# Altium project 越野组一体板.PrjPCB
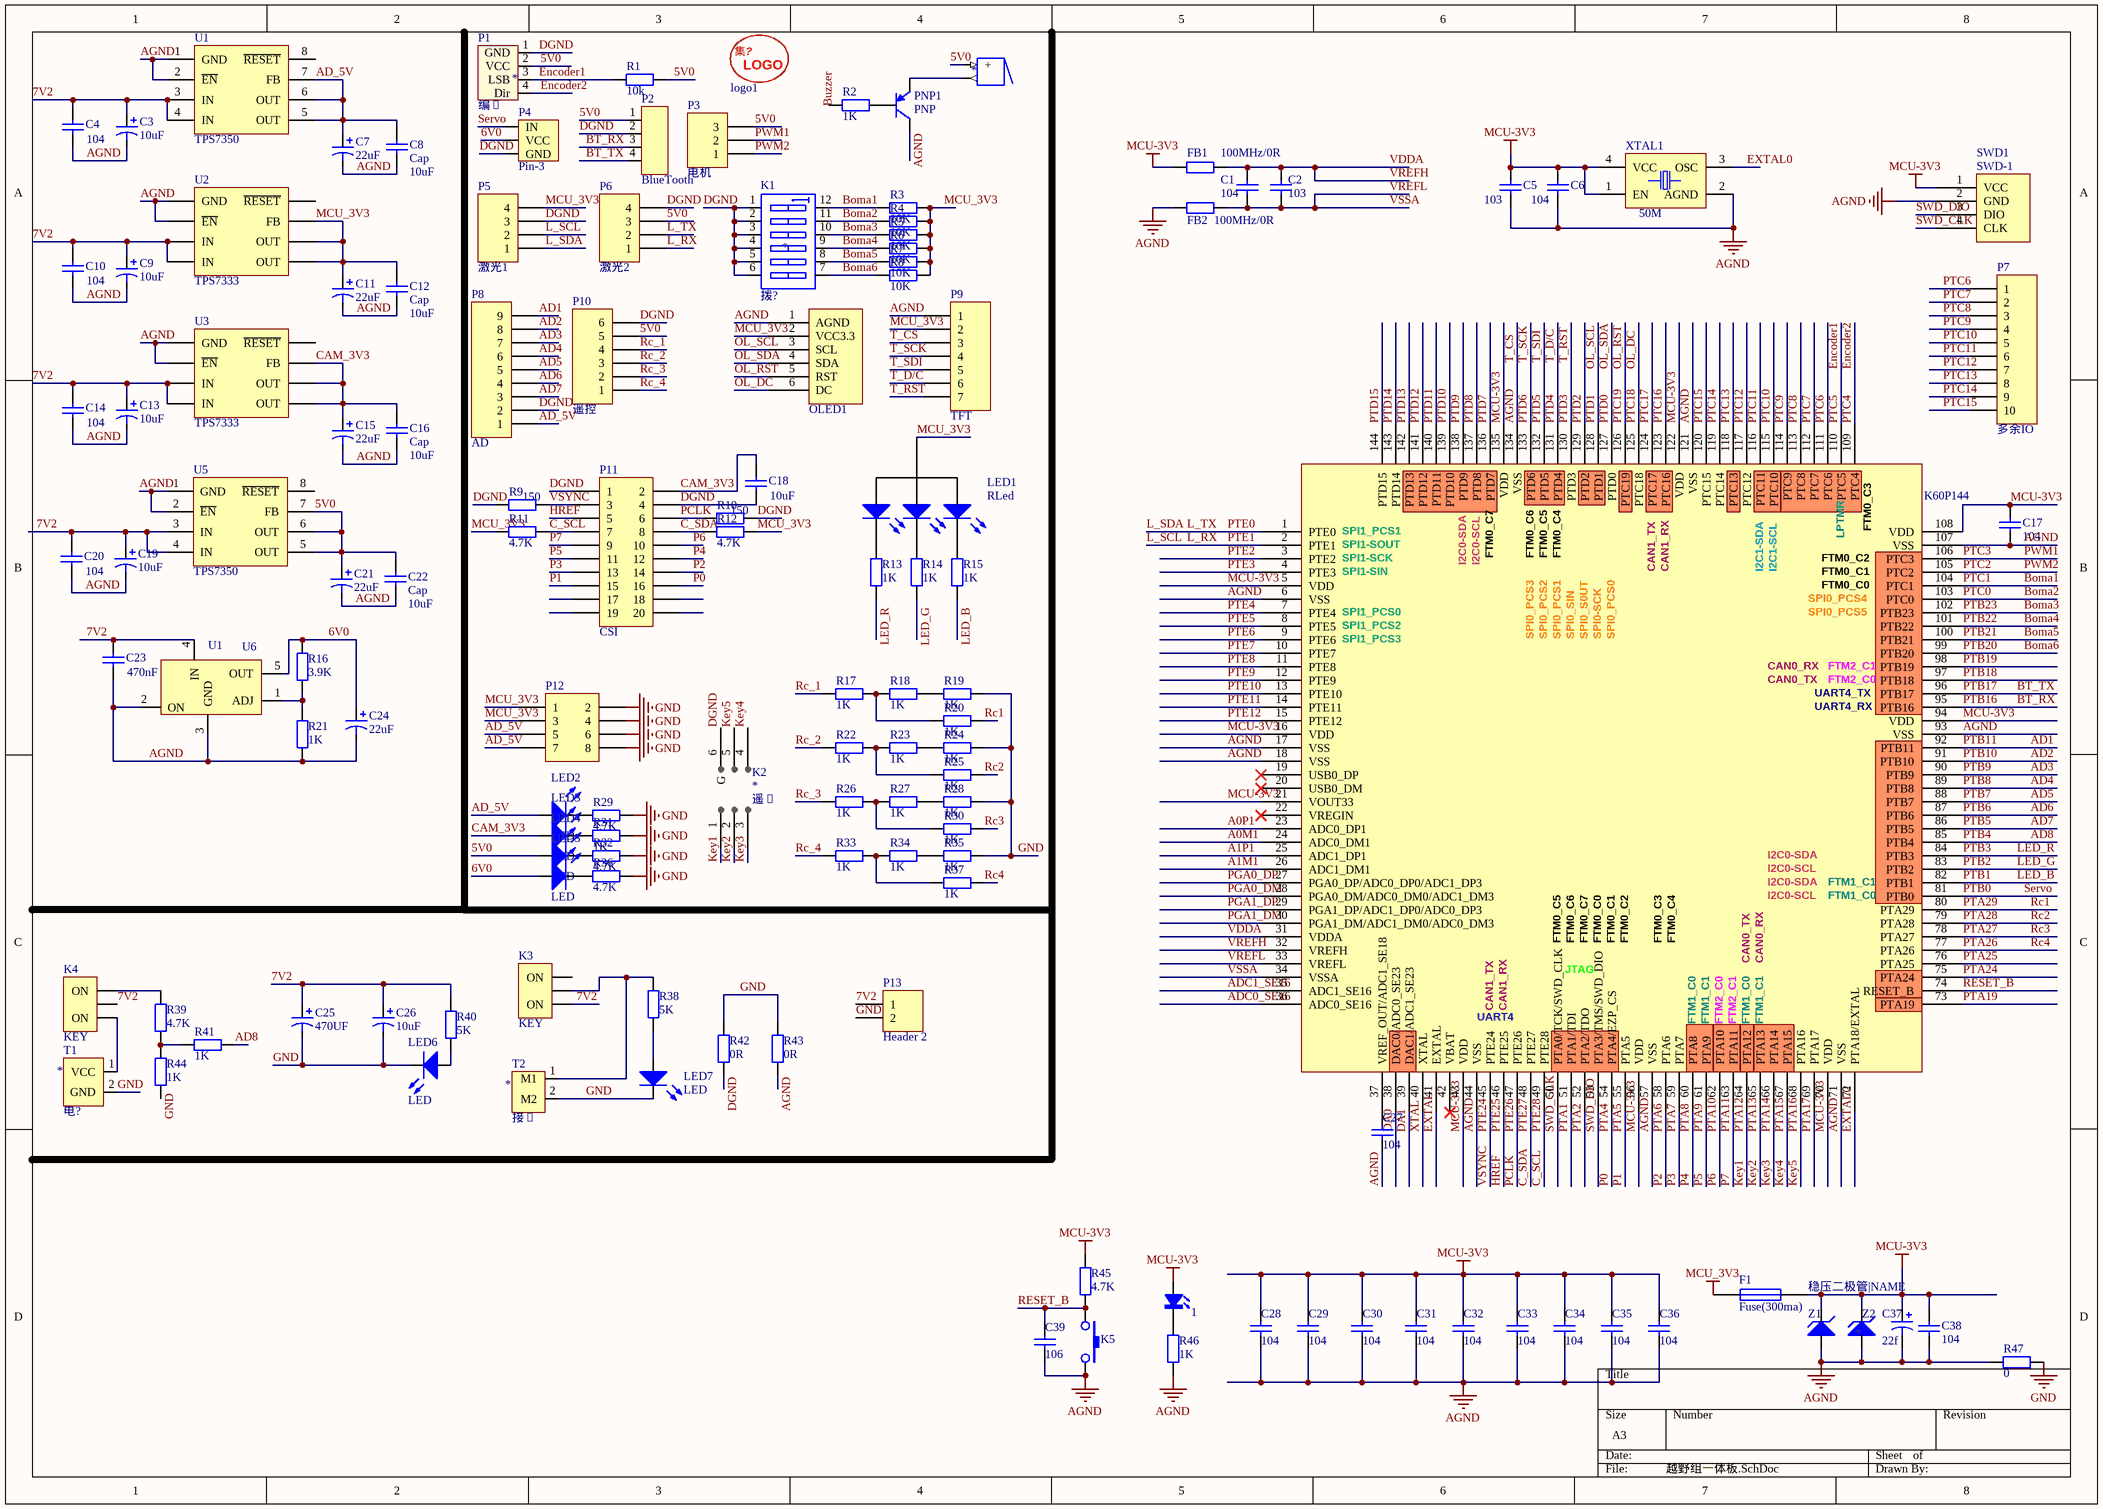
[diagram p0: 越野组一体板.SchDoc]
1 sheet, 131 parts. Net scope: global (net labels, ports and power ports of the same name join across sheets).
Board file: 越野组一体板.PcbDoc

## Sheet 越野组一体板.SchDoc
size A3

### Parts
1  LED  [0805LED1]  (value not drawn)
BUZZER1  *  [Buzzer]
C1  104  [0805-0C]
C2  103  [0805-0C]
C3  value 10uF  [pol cap(10uF)]  (hidden comment: pol cap)
C4  value 104  [0805]
C5  103  [0805-0C]
C6  104  [0805-0C]
C7  value 22uF  [pol cap(10uF)]  (hidden comment: pol cap)
C8  Cap  value 10uF  [0805]
C9  value 10uF  [pol cap(10uF)]  (hidden comment: pol cap)
C10  value 104  [0805]
C11  value 22uF  [pol cap(10uF)]  (hidden comment: pol cap)
C12  Cap  value 10uF  [0805]
C13  value 10uF  [pol cap(10uF)]  (hidden comment: pol cap)
C14  value 104  [0805]
C15  value 22uF  [pol cap(10uF)]  (hidden comment: pol cap)
C16  Cap  value 10uF  [0805]
C17  104  [0805-0C]
C18  value 10uF  [0805]
C19  value 10uF  [pol cap(10uF)]  (hidden comment: pol cap)
C20  value 104  [0805]
C21  value 22uF  [pol cap(10uF)]  (hidden comment: pol cap)
C22  Cap  value 10uF  [0805]
C23  value 470nF  [0805]
C24  value 22uF  [pol cap(10uF)]  (hidden comment: pol cap)
C25  470UF  [ED8]
C26  value 10uF  [pol cap(10uF)]  (hidden comment: 1UF)
C27  104  [0805-0C]
C28  104  [0805-0C]
C29  104  [0805-0C]
C30  104  [0805-0C]
C31  104  [0805-0C]
C32  104  [0805-0C]
C33  104  [0805-0C]
C34  104  [0805-0C]
C35  104  [0805-0C]
C36  104  [0805-0C]
C37  22f  [3528-B-TA]
C38  104  [0805-0C]
C39  106  [0805-0C]
F1  Fuse(300ma)  [1206R]
FB1  100MHz/0R  [0805]
FB2  100MHz/0R  [0805]
K1  *  [拨码开关*6]
K2  *  [摇杆开关]
K3  KEY  [钮子开关（大）]
K4  KEY  [钮子开关（大）]
K5  RESET  [SW_PB2_A1]  (value not drawn)
LED1  RLed  [Rled]
LED2  LED  [LED(0805)]
LED3  LED  [LED(0805)]
LED4  LED  [LED(0805)]
LED5  LED  [LED(0805)]
LED6  LED  [LED(0805)]
LED7  LED  [LED(0805)]
logo1  LOGO(JMU)  [JMU_logo（1）]  (value not drawn)
OLED1  OLED  [S0P6]  (value not drawn)
P1  *  [编码器]
P2  BlueTooth  [插针——4]
P3  电机  [HDR1X3]
P4  Pin-3  [HDR_1X3]
P5  激光1  [HDR1X4]
P6  激光2  [HDR1X4]
P7  多余IO  [HDR1X10]
P8  AD  [HDR1X9]
P9  TFT  [HDR1X7]
P10  遥控  [HDR1X6]
P11  CSI  [HDR2X10]
P12  Header 4X2  [HDR2X4]  (value not drawn)
P13  Header 2  [HDR1X2]
PNP1  PNP  [PNP]
R1  10k  [0805]
R2  1K  [0805]
R3  10K  [0805]
R4  10K  [0805]
R5  10K  [0805]
R6  10K  [0805]
R7  10K  [0805]
R8  10K  [0805]
R9  150  [0805]
R10  150  [0805]
R11  4.7K  [0805]
R12  4.7K  [0805]
R13  1K  [0805]
R14  1K  [0805]
R15  1K  [0805]
R16  3.9K  [0805]
R17  1K  [0805]
R18  1K  [0805]
R19  1K  [0805]
R20  1K  [0805]
R21  1K  [0805]
R22  1K  [0805]
R23  1K  [0805]
R24  1K  [0805]
R25  1K  [0805]
R26  1K  [0805]
R27  1K  [0805]
R28  1K  [0805]
R29  4.7K  [0805]
R30  1K  [0805]
R31  1K  [0805]
R32  4.7K  [0805]
R33  1K  [0805]
R34  1K  [0805]
R35  1K  [0805]
R36  4.7K  [0805]
R37  1K  [0805]
R38  5K  [0805]
R39  4.7K  [0805]
R40  5K  [0805]
R41  1K  [0805]
R42  0R  [0805]
R43  0R  [0805]
R44  1K  [0805]
R45  4.7K  [0603-r]
R46  1K  [0603-r]
R47  0  [0603-r]
SWD1  SWD-1  [S0P4]  (value not drawn)
T1  *  [T型接头]
T2  *  [接线端子]
U1  TPS7350  [SOIC-8]
U2  TPS7333  [SOIC-8]
U3  TPS7333  [SOIC-8]
U4  K60P144  [LQFP144]
U5  TPS7350  [SOIC-8]
U6  U1  [LM2941]
XTAL1  50M  [XTAL-3225]
Z1  Zener  [0805-0C]  (value not drawn)
Z2  *  [0805-0C]

### Nets
AGND: C3.2 C4.1 C5.2 C6.1 C7.2 C8.1 C9.2 C10.1 C11.2 C12.1 C13.2 C14.1 C15.2 C16.1 C17.2 C19.2 C20.1 C21.2 C22.1 C23.1 C24.2 C27.1 C28.1 C29.1 C30.1 C31.1 C32.1 C33.1 C34.1 C35.1 C36.1 C37.2 C38.2 C39.1 FB2.2 K5.2 OLED1.1(AGND) P9.1 P9.3 PNP1.1(C) R21.1 R43.2 R46.1 R47.1 SWD1.2(GND) U1.1(GND) U1.2(~{EN}) U2.1(GND) U2.2(~{EN}) U3.1(GND) U3.2(~{EN}) U4.6(VSS) U4.17(VSS) U4.18(VSS) U4.44(VSS) U4.57(VSS) U4.71(VSS) U4.93(VSS) U4.107(VSS) U4.121(VSS) U4.134(VSS) U5.1(GND) U5.2(~{EN}) U6.2(ON) U6.3(GND) XTAL1.2(AGND) Z1.1(A) Z2.1(A)  [also labelled T_CS]
GND: C25.2 C26.2 LED6.2(K) LED7.2(K) P12.2 P12.4 P12.6 P12.8 P13.2 R19.2 R24.2 R28.2 R29.2 R31.2 R32.2 R35.2 R36.2 R42.1 R43.1 R47.2 T1.2(GND) T2.2(M2)
MCU-3V3: 1.1(K) C5.1 C6.2 C17.1 C28.2 C29.2 C30.2 C31.2 C32.2 C33.2 C34.2 C35.2 C36.2 C37.1 C38.1 F1.1 FB1.2 R45.2 SWD1.1(VCC) U4.5(VDD) U4.16(VDD) U4.21(VOUT33) U4.43(VDD) U4.56(VDD) U4.70(VDD) U4.94(VDD) U4.108(VDD) U4.122(VDD) U4.135(VDD) XTAL1.1(EN) XTAL1.4(VCC) Z1.2(K) Z2.2(K)
MCU_3V3: C11.1 C12.2 F1.2 LED1.4(K4) OLED1.2(VCC3.3) P5.4 P9.2 P12.1 P12.3 R3.1 R4.1 R5.1 R6.1 R7.1 R8.1 R11.1 R12.2 U2.5(OUT) U2.6(OUT) U2.7(FB)
5V0: BUZZER1.1(+) C21.1 C22.2 LED4.1(A) P1.2(VCC) P2.1 P3.3 P6.3 P10.5 R1.2 U5.5(OUT) U5.6(OUT) U5.7(FB)
6V0: C24.1 LED5.1(A) P4.2(VCC) R16.2 U6.5(OUT)
7V2: C3.1 C4.2 C9.1 C10.2 C13.1 C14.2 C19.1 C20.2 C23.2 C25.1 C26.1 K3.1(ON) K4.2(com) P13.1 R40.2 U1.3(IN) U1.4(IN) U2.3(IN) U2.4(IN) U3.3(IN) U3.4(IN) U5.3(IN) U5.4(IN) U6.4(IN)
A0M1: U4.24(ADC0_DM1)
A0P1: U4.23(ADC0_DP1)
A1M1: U4.26(ADC1_DM1)
A1P1: U4.25(ADC1_DP1)
AD1: P8.9 U4.92(PTB11)  [also labelled PTB11]
AD2: P8.8 U4.91(PTB10)  [also labelled PTB10]
AD3: P8.7 U4.90(PTB9)  [also labelled PTB9]
AD4: P8.6 U4.89(PTB8)  [also labelled PTB8]
AD5: P8.5 U4.88(PTB7)  [also labelled PTB7]
AD6: P8.4 U4.87(PTB6)  [also labelled PTB6]
AD7: P8.3 U4.86(PTB5)  [also labelled PTB5]
AD8: R41.1 U4.85(PTB4)  [also labelled PTB4]
AD_5V: C7.1 C8.2 LED2.1(A) P8.1 P12.5 P12.7 U1.5(OUT) U1.6(OUT) U1.7(FB)
ADC0_SE16: U4.36(ADC0_SE16)
ADC1_SE16: U4.35(ADC1_SE16)
Boma1: K1.12(B1) R3.2 U4.104(PTC1)  [also labelled PTC1]
Boma2: K1.11(B2) R4.2 U4.103(PTC0)  [also labelled PTC0]
Boma3: K1.10(B3) R5.2 U4.102(PTB23)  [also labelled PTB23]
Boma4: K1.9(B4) R6.2 U4.101(PTB22)  [also labelled PTB22]
Boma5: K1.8(B5) R7.2 U4.100(PTB21)  [also labelled PTB21]
Boma6: K1.7(B5) R8.2 U4.99(PTB20)  [also labelled PTB20]
BT_RX: P2.3 U4.95(PTB16)  [also labelled PTB16]
BT_TX: P2.4 U4.96(PTB17)  [also labelled PTB17]
C_SCL: P11.7 R11.2 U4.49(PTE28)  [also labelled PTE28]
C_SDA: P11.8 R12.1 U4.48(PTE27)  [also labelled PTE27]
CAM_3V3: C15.1 C16.2 C18.2 LED3.1(A) P11.2 U3.5(OUT) U3.6(OUT) U3.7(FB)
DA0: U4.38(DAC0/ADC0_SE23)
DA1: U4.39(DAC1/ADC1_SE23)
DGND: C18.1 K1.1(A1) K1.2(A2) K1.3(A3) K1.4(A4) K1.5(A5) K1.6(A5) K2.6(G) P1.1(GND) P2.2 P4.3(GND) P5.3 P6.4 P8.2 P10.6 P11.1 P11.4 R9.1 R10.2 R42.2
Encoder1: P1.3(LSB) R1.1 U4.110(PTC5)  [also labelled PTC5]
Encoder2: P1.4(Dir) U4.109(PTC4)  [also labelled PTC4]
EXTAL: U4.41(EXTAL)
EXTAL0: U4.72(PTA18/EXTAL) XTAL1.3(OSC)
HREF: P11.5 U4.46(PTE25)  [also labelled PTE25]
Key1: K2.1 U4.64(PTA12)  [also labelled PTA12]
Key2: K2.2 U4.65(PTA13)  [also labelled PTA13]
Key3: K2.3 U4.66(PTA14)  [also labelled PTA14]
Key4: K2.4 U4.67(PTA15)  [also labelled PTA15]
Key5: K2.5 U4.68(PTA16)  [also labelled PTA16]
L_RX: P5.2 P6.1 U4.2(PTE1)  [also labelled L_SCL, PTE1]
L_SDA: P5.1 P6.2 U4.1(PTE0)  [also labelled L_TX, PTE0]
LED_B: R15.1 U4.82(PTB1)  [also labelled PTB1]
LED_G: R14.1 U4.83(PTB2)  [also labelled PTB2]
LED_R: R13.1 U4.84(PTB3)  [also labelled PTB3]
OL_DC: OLED1.6(DC) U4.125(PTC18)  [also labelled PTC18]
OL_RST: OLED1.5(RST) U4.126(PTC19)  [also labelled PTC19]
OL_SCL: OLED1.3(SCL) U4.128(PTD1)  [also labelled PTD1]
OL_SDA: OLED1.4(SDA) U4.127(PTD0)  [also labelled PTD0]
P0: P11.16 U4.54(PTA4/EZP_CS)  [also labelled PTA4]
P1: P11.15 U4.55(PTA5)  [also labelled PTA5]
P2: P11.14 U4.58(PTA6)  [also labelled PTA6]
P3: P11.13 U4.59(PTA7)  [also labelled PTA7]
P4: P11.12 U4.60(PTA8)  [also labelled PTA8]
P5: P11.11 U4.61(PTA9)  [also labelled PTA9]
P6: P11.10 U4.62(PTA10)  [also labelled PTA10]
P7: P11.9 U4.63(PTA11)  [also labelled PTA11]
PCLK: P11.6 R10.1 U4.47(PTE26)  [also labelled PTE26]
PGA0_DM: U4.28(PGA0_DM/ADC0_DM0/ADC1_DM3)
PGA0_DP: U4.27(PGA0_DP/ADC0_DP0/ADC1_DP3)
PGA1_DM: U4.30(PGA1_DM/ADC1_DM0/ADC0_DM3)
PGA1_DP: U4.29(PGA1_DP/ADC1_DP0/ADC0_DP3)
PTA1: U4.51(PTA1/TDI)
PTA2: U4.52(PTA2/TDO)
PTA17: U4.69(PTA17)
PTA19: U4.73(PTA19)
PTA24: U4.75(PTA24)
PTA25: U4.76(PTA25)
PTA26: R37.2 U4.77(PTA26)  [also labelled Rc4]
PTA27: R30.2 U4.78(PTA27)  [also labelled Rc3]
PTA28: R25.2 U4.79(PTA28)  [also labelled Rc2]
PTA29: R20.2 U4.80(PTA29)  [also labelled Rc1]
PTB0: P4.1(IN) U4.81(PTB0)  [also labelled Servo]
PTB18: U4.97(PTB18)
PTB19: U4.98(PTB19)
PTC2: P3.1 U4.105(PTC2)  [also labelled PWM2]
PTC3: P3.2 U4.106(PTC3)  [also labelled PWM1]
PTC6: P7.1 U4.111(PTC6)
PTC7: P7.2 U4.112(PTC7)
PTC8: P7.3 U4.113(PTC8)
PTC9: P7.4 U4.114(PTC9)
PTC10: P7.5 U4.115(PTC10)
PTC11: P7.6 U4.116(PTC11)
PTC12: P7.7 U4.117(PTC12)
PTC13: P7.8 U4.118(PTC13)
PTC14: P7.9 U4.119(PTC14)
PTC15: P7.10 U4.120(PTC15)
PTC16: U4.123(PTC16)
PTC17: U4.124(PTC17)
PTD2: U4.129(PTD2)
PTD3: P9.7 U4.130(PTD3)  [also labelled T_RST]
PTD4: P9.6 U4.131(PTD4)  [also labelled T_D/C]
PTD5: P9.5 U4.132(PTD5)  [also labelled T_SDI]
PTD6: P9.4 U4.133(PTD6)  [also labelled T_SCK]
PTD7: U4.136(PTD7)
PTD8: U4.137(PTD8)
PTD9: U4.138(PTD9)
PTD10: U4.139(PTD10)
PTD11: U4.140(PTD11)
PTD12: U4.141(PTD12)
PTD13: U4.142(PTD13)
PTD14: U4.143(PTD14)
PTD15: U4.144(PTD15)
PTE2: U4.3(PTE2)
PTE3: U4.4(PTE3)
PTE4: U4.7(PTE4)
PTE5: U4.8(PTE5)
PTE6: U4.9(PTE6)
PTE7: U4.10(PTE7)
PTE8: U4.11(PTE8)
PTE9: U4.12(PTE9)
PTE10: U4.13(PTE10)
PTE11: U4.14(PTE11)
PTE12: U4.15(PTE12)
PTE24: P11.3 R9.2 U4.45(PTE24)  [also labelled VSYNC]
Rc_1: P10.4 R17.1
Rc_2: P10.3 R22.1
Rc_3: P10.2 R26.1
Rc_4: P10.1 R33.1
RESET_B: C39.2 K5.1 R45.1 U4.74(RESET_B)
SWD_CLK: SWD1.4(CLK) U4.50(PTA0/TCK/SWD_CLK)
SWD_DIO: SWD1.3(DIO) U4.53(PTA3/TMS/SWD_DIO)
VDDA: C1.2 C2.2 FB1.1 U4.31(VDDA) U4.32(VREFH)  [also labelled VREFH]
VREFL: C1.1 C2.1 FB2.1 U4.33(VREFL) U4.34(VSSA)  [also labelled VSSA]
XTAL: U4.40(XTAL)
Net1_2: 1.2(A) R46.2
NetBUZZER1_2: BUZZER1.2 PNP1.3(E)
NetC27_2: C27.2 U4.37(VREF_OUT/ADC1_SE18)
NetK3_2: K3.2(com) R38.2 T2.1(M1)
NetK4_1: K4.1(ON) T1.1(VCC)
NetK4_3: K4.3(ON) R39.2
NetLED1_1: LED1.1(K1) R13.2
NetLED1_2: LED1.2(K2) R14.2
NetLED1_3: LED1.3(K3) R15.2
NetLED2_2: LED2.2(K) R29.1
NetLED3_2: LED3.2(K) R31.1
NetLED4_2: LED4.2(K) R32.1
NetLED5_2: LED5.2(K) R36.1
NetLED6_1: LED6.1(A) R40.1
NetLED7_1: LED7.1(A) R38.1
NetPNP1_2: PNP1.2(B) R2.1
NetR16_1: R16.1 R21.2 U6.1(ADJ)
NetR17_2: R17.2 R18.1 R20.1
NetR18_2: R18.2 R19.1
NetR22_2: R22.2 R23.1 R25.1
NetR23_2: R23.2 R24.1
NetR26_2: R26.2 R27.1 R30.1
NetR27_2: R27.2 R28.1
NetR33_2: R33.2 R34.1 R37.1
NetR34_2: R34.2 R35.1
NetR39_1: R39.1 R41.2 R44.2

Not connected (* = marked no-connect by the designer): K3 3(ON); P11 17 18 19 20; R2 2; R44 1; U1 8(~{RESET}); U2 8(~{RESET}); U3 8(~{RESET}); U4 19(USB0_DP)* 20(USB0_DM)* 22(VREGIN)* 42(VBAT)*; U5 8(~{RESET})

### Notes on the sheet
- (near U4) SPI1-SCK
- (near U4) SPI1-SOUT
- (near U4) SPI1-SIN
- (near U4) SPI1_PCS1
- (near U4) I2C0-SDA
- (near U4) I2C0-SCL
- (near U4) FTM0_C7
- (near U4) FTM0_C6
- (near U4) FTM0_C5
- (near U4) FTM0_C4
- (near U4) CAN1_TX
- (near U4) CAN1_RX
- (near U4) I2C1-SDA
- (near U4) I2C1-SCL
- (near U4) FTM0_C0
- (near U4) FTM0_C1
- (near U4) FTM0_C2
- (near U4) LPTMR
- (near U4) FTM0_C3
- (near U4) SPI1_PCS0
- (near U4) SPI1_PCS2
- (near U4) SPI1_PCS3
- (near U4) SPI0_PCS3
- (near U4) SPI0_PCS2
- (near U4) SPI0_PCS1
- (near U4) SPI0_SIN
- (near U4) SPI0_S0UT
- (near U4) SPI0-SCK
- (near U4) SPI0_PCS0
- (near U4) SPI0_PCS4
- (near U4) SPI0_PCS5
- (near U4) CAN0_TX
- (near U4) CAN0_RX
- (near U4) UART4_TX
- (near U4) UART4_RX
- (near U4) FTM2_C0
- (near U4) FTM2_C1
- (near U4) FTM1_C0
- (near U4) FTM1_C1
- (near U4) JTAG
- (near U4) UART4
- Labels drawn without touching a wire or pin: Buzzer, GND
- (in symbol JMU-LOGO) 集?; LOGO
- (in symbol Zener) 稳压二极管|NAME
- (in symbol 拨码开关（6位）) 拨?
- (in symbol 接线端子) 接�
- (in symbol 电源接线端子) 电?
- (in symbol 编码器) 编�
- (in symbol 遥感开关) 遥�

### Library data of the parts
BUZZER1 = Buzzer(有源蜂鸣器)
C1 C2 C5 C6 C17 C27-C36 C38 C39 = CAP
C3 C7 C9 C11 C13 C15 C19 C21 C24 C26 = pol cap: 通用有极电容
C4 C8 C10 C12 C14 C16 C18 C20 C22 C23 = Cap: 无极电容
C25 = 固态贴片电容: ED8:470UF  ED6.3:100UF
C37 = CAP-TAN
F1 = Fuse
FB1 FB2 = RES: Value: 0
K1 = 拨码开关（6位）
K2 = 遥感开关
K3 K4 = 钮子开关（大）: AC 250V/6A
K5 = K: 按键
LED2-LED7 = LED: 发光二极管
logo1 = JMU-LOGO
P1 = 编码器
P2 = 插针——4
P3 = Header 3: Header, 3-Pin; LatestRevisionDate: 17-Jul-2002; LatestRevisionNote: Re-released for DXP Platform.; Publisher: Altium Limited
P4 = 舵机: 舵机...
P5 P6 = Header 4: Header, 4-Pin; LatestRevisionDate: 17-Jul-2002; LatestRevisionNote: Re-released for DXP Platform.; Publisher: Altium Limited
P7 = Header 10: Header, 10-Pin; LatestRevisionDate: 17-Jul-2002; LatestRevisionNote: Re-released for DXP Platform.; Publisher: Altium Limited
P8 = Header 9: Header, 9-Pin; LatestRevisionDate: 17-Jul-2002; LatestRevisionNote: Re-released for DXP Platform.; Publisher: Altium Limited
P9 = Header 7: Header, 7-Pin; LatestRevisionDate: 17-Jul-2002; LatestRevisionNote: Re-released for DXP Platform.; Publisher: Altium Limited
P10 = Header 6: Header, 6-Pin; LatestRevisionDate: 17-Jul-2002; LatestRevisionNote: Re-released for DXP Platform.; Publisher: Altium Limited
P11 = Header 10X2: Header, 10-Pin, Dual row; LatestRevisionDate: 17-Jul-2002; LatestRevisionNote: Re-released for DXP Platform.; Publisher: Altium Limited
P12 = Header 4X2: Header, 4-Pin, Dual row; LatestRevisionDate: 17-Jul-2002; LatestRevisionNote: Re-released for DXP Platform.; Publisher: Altium Limited
P13 = Header 2: Header, 2-Pin; LatestRevisionDate: 17-Jul-2002; LatestRevisionNote: Re-released for DXP Platform.; Publisher: Altium Limited
R1 R3-R8 = Res: 通用电阻; Value: 10K
R2 R9-R44 = Res: 通用电阻; Value: 10K
R45-R47 = RES
T1 = 电源接线端子: 电源线
T2 = 接线端子
U1 U5 = TPS7350: 稳压元件（5V）
U2 U3 = TPS7333: 稳压元件（3.3V）
U6 = LM2941: 稳压元件-->6V
XTAL1 = XTAL
Z2 = Zener